# EAGLE design schemat (EAGLE 5.10)
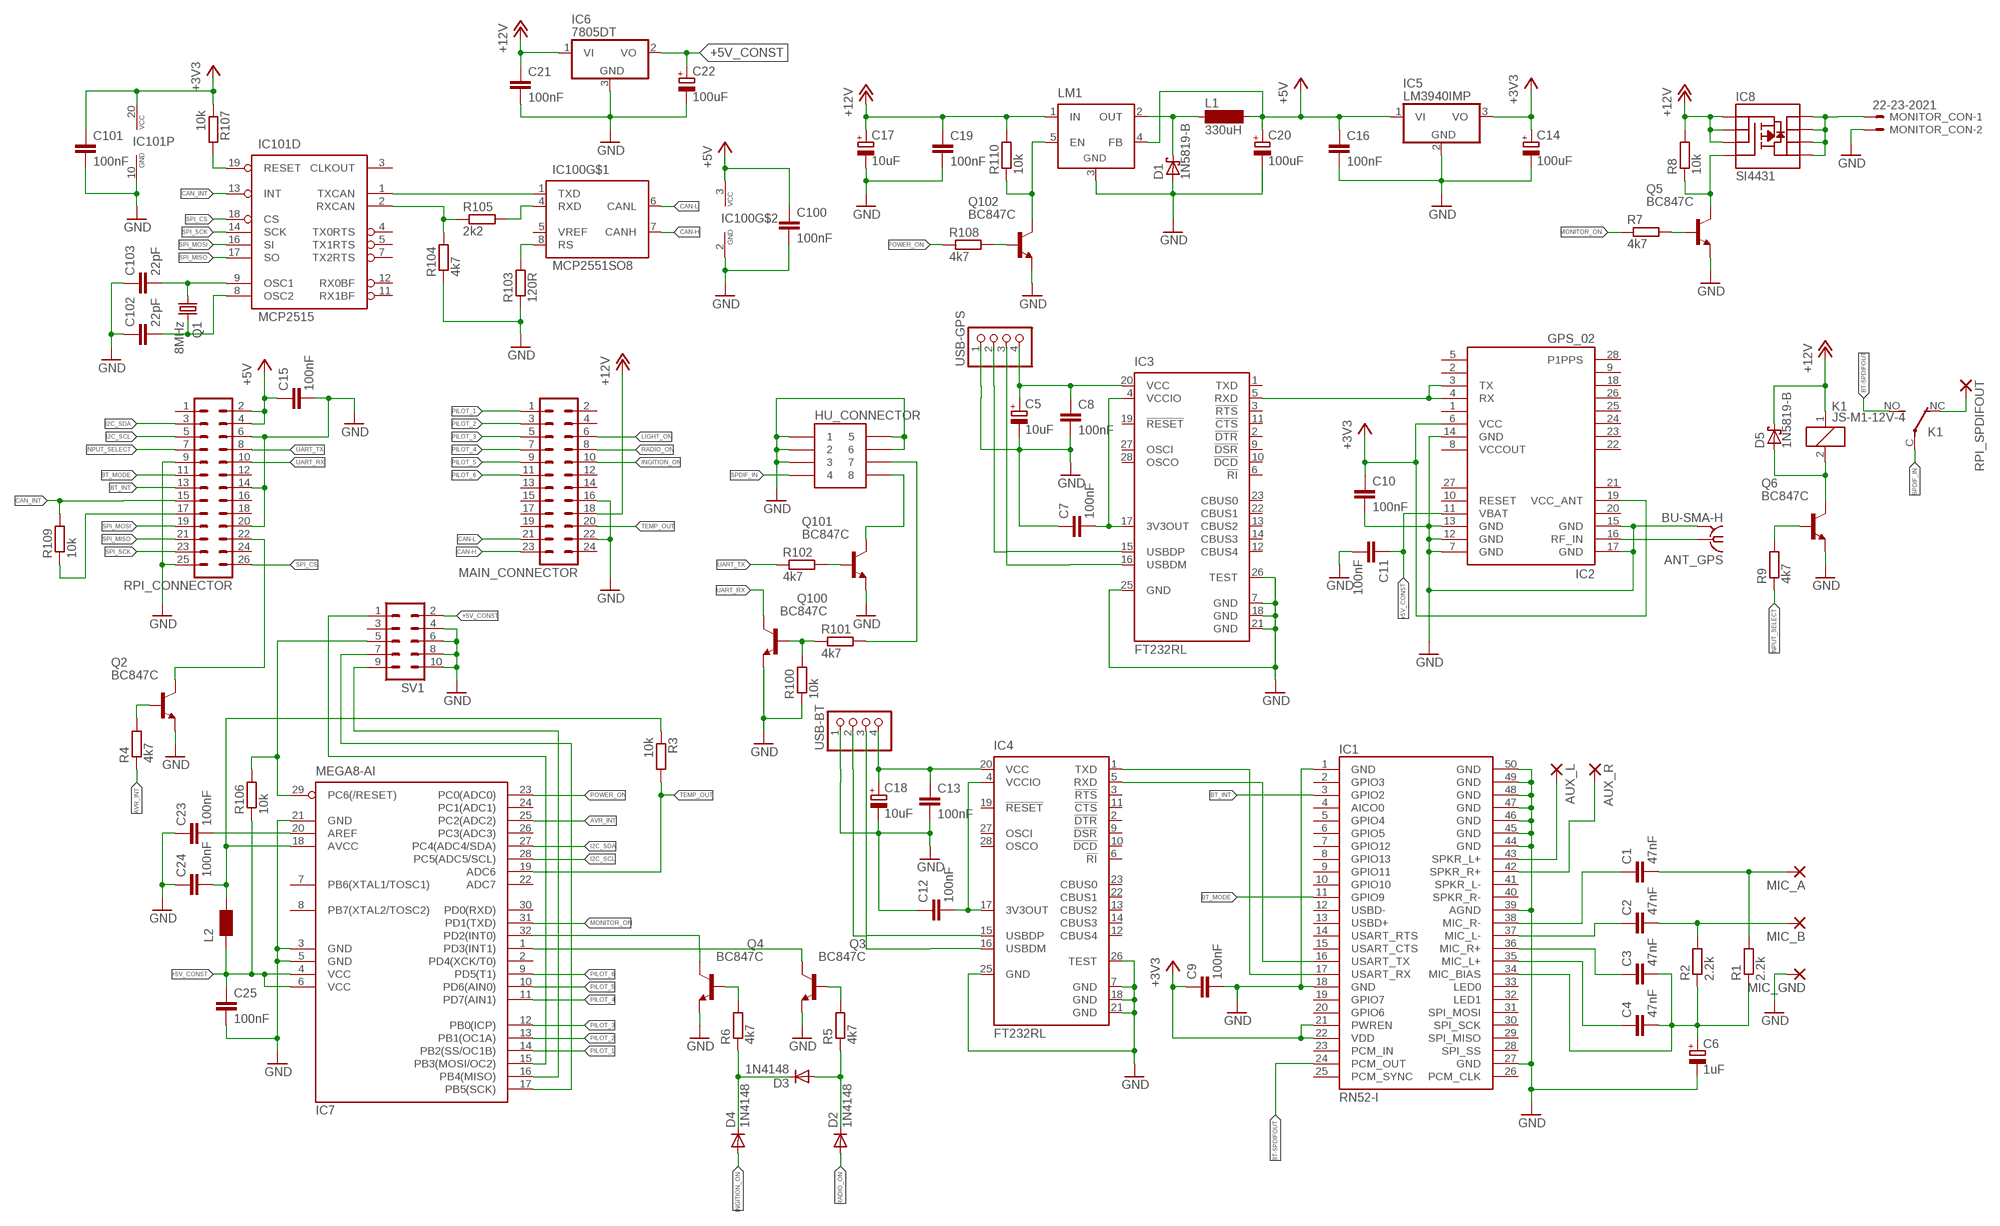
[diagram p0: schematic, sheet 1]

## Parts
ANT_GPS  BU-SMA-H  [BU-SMA-H]
AUX_L  1,6/0,8  [1,6/0,8]
AUX_R  1,6/0,8  [1,6/0,8]
C1  47nF  C-EUC0805  [C0805]
C2  47nF  C-EUC0805  [C0805]
C3  47nF  C-EUC0805  [C0805]
C4  47nF  C-EUC0805  [C0805]
C5  10uF  CPOL-EU153CLV-0605  [153CLV-0605]
C6  1uF  CPOL-EU153CLV-0605  [153CLV-0605]
C7  100nF  C-EUC0805  [C0805]
C8  100nF  C-EUC0805  [C0805]
C9  100nF  C-EUC0805  [C0805]
C10  100nF  C-EUC0805  [C0805]
C11  100nF  C-EUC0805  [C0805]
C12  100nF  C-EUC0805  [C0805]
C13  100nF  C-EUC0805  [C0805]
C14  100uF  CPOL-EU153CLV-0605  [153CLV-0605]
C15  100nF  C-EUC0805  [C0805]
C16  100nF  C-EUC0805  [C0805]
C17  10uF  CPOL-EU153CLV-0605  [153CLV-0605]
C18  10uF  CPOL-EU153CLV-0605  [153CLV-0605]
C19  100nF  C-EUC0805  [C0805]
C20  100uF  CPOL-EU153CLV-0605  [153CLV-0605]
C21  100nF  C-EUC0805  [C0805]
C22  100uF  CPOL-EU153CLV-0605  [153CLV-0605]
C23  100nF  C-EUC0805  [C0805]
C24  100nF  C-EUC0805  [C0805]
C25  100nF  C-EUC0805  [C0805]
C100  100nF  C-EUC0805  [C0805]
C101  100nF  C-EUC0805  [C0805]
C102  22pF  C-EUC0805  [C0805]
C103  22pF  C-EUC0805  [C0805]
D1  1N5819-B  [DO41-7.6]
D2  1N4148  1N4148DO35-7  [DO35-7]
D3  1N4148  1N4148DO35-7  [DO35-7]
D4  1N4148  1N4148DO35-7  [DO35-7]
D5  1N5819-B  [DO41-7.6]
HU_CONNECTOR  MRX56908CV  [MRX56908]
IC1  RN52-I  [RN-52]
IC2  GPS_02  [GPS_02]
IC3  FT232RL  [SSOP28]
IC4  FT232RL  [SSOP28]
IC5  LM3940IMP  [SOT223]
IC6  7805DT  [TO252]
IC7  MEGA8-AI  [TQFP32-08]
IC8  SI4431  MOSFET-PCHANNEL-SOIC8SOIC8  [SO08]
IC100  MCP2551SO8  [SO08]
IC101  MCP2515  MCP2515ST  [TSSOP20]
K1  JS-M1-12V-4  [JS-M]
L1  330uH  DLCSN136S  [DLCSN136S]
L2  WE-MK_0805  [0805]
LM1  LM2596TH  [TO220-52]
MAIN_CONNECTOR  MA12-2  [MA12-2]
MIC_A  3,81/1,4  [3,81/1,4]
MIC_B  3,81/1,4  [3,81/1,4]
MIC_GND  3,81/1,4  [3,81/1,4]
MONITOR_CON  22-23-2021  [22-23-2021]
Q1  8MHz  CRYSTALHC49S  [HC49/S]
Q2  BC847C  BC847C-NPN-SOT23-BEC  [SOT23-BEC]
Q3  BC847C  BC847C-NPN-SOT23-BEC  [SOT23-BEC]
Q4  BC847C  BC847C-NPN-SOT23-BEC  [SOT23-BEC]
Q5  BC847C  BC847C-NPN-SOT23-BEC  [SOT23-BEC]
Q6  BC847C  BC847C-NPN-SOT23-BEC  [SOT23-BEC]
Q100  BC847C  BC847C-NPN-SOT23-BEC  [SOT23-BEC]
Q101  BC847C  BC847C-NPN-SOT23-BEC  [SOT23-BEC]
Q102  BC847C  BC847C-NPN-SOT23-BEC  [SOT23-BEC]
R1  2.2k  R-EU_M0805  [M0805]
R2  2.2k  R-EU_M0805  [M0805]
R3  10k  R-EU_R0805  [R0805]
R4  4k7  R-EU_R0805  [R0805]
R5  4k7  R-EU_M0805  [M0805]
R6  4k7  R-EU_M0805  [M0805]
R7  4k7  R-EU_M0805  [M0805]
R8  10k  R-EU_M0805  [M0805]
R9  4k7  R-EU_M0805  [M0805]
R100  10k  R-EU_M0805  [M0805]
R101  4k7  R-EU_M0805  [M0805]
R102  4k7  R-EU_M0805  [M0805]
R103  120R  R-EU_R0805  [R0805]
R104  4k7  R-EU_R0805  [R0805]
R105  2k2  R-EU_R0805  [R0805]
R106  10k  R-EU_R0805  [R0805]
R107  10k  R-EU_R0805  [R0805]
R108  4k7  R-EU_M0805  [M0805]
R109  10k  R-EU_R0805  [R0805]
R110  10k  R-EU_M0805  [M0805]
RPI_CONNECTOR  MA13-2  [MA13-2]
RPI_SPDIFOUT  3,17/1,1  [3,17/1,1]
SV1  ML10  [ML10]
USB-BT  PINHD-1X4  [1X04]
USB-GPS  PINHD-1X4  [1X04]

## Nets
+3V3 [zasilanie]: C9.1 C10.1 C14.+ C101.1 IC1.21(PWREN) IC1.22(VDD) IC2.6(VCC) IC2.19(VCC_ANT) IC5.3(VO) IC101.20(P:VCC) R107.1
+5V [zasilanie]: C15.1 C16.1 C20.+ C100.1 IC5.1(VI) IC100.3(VCC) L1.P$2 LM1.4(FB) RPI_CONNECTOR.2 RPI_CONNECTOR.4
+5V_CONST [zasilanie]: C11.1 C22.+ C25.1 IC2.11(VBAT) IC6.2(VO) IC7.4(VCC) IC7.6(VCC) L2.1 R106.1 SV1.2
+12V: C17.+ C19.1 C21.1 D5.C IC6.1(VI) IC8.1(S) IC8.2(S) IC8.3(S) K1.1 LM1.1(IN) MAIN_CONNECTOR.18 R8.2 R110.2
AVCC: C24.2 IC7.18(AVCC) L2.2 R3.1
AVR_INT: IC7.25(PC2(ADC2)) R4.1
BT-SPDIFOUT: IC1.24(PCM_OUT) K1.NO(2:S)
BT_INT: IC1.3(GPIO2) RPI_CONNECTOR.13
BT_MODE: IC1.11(GPIO9) RPI_CONNECTOR.11
CAN-H: IC100.7(CANH) MAIN_CONNECTOR.23
CAN-L: IC100.6(CANL) MAIN_CONNECTOR.21
CAN_INT: IC101.13(D:INT) R109.2 RPI_CONNECTOR.15
GND: ANT_GPS.2(GND) C5.- C6.- C7.1 C8.2 C9.2 C10.2 C11.2 C12.1 C13.2 C14.- C15.2 C16.2 C17.- C18.- C19.2 C20.- C21.2 C22.- C23.1 C24.1 C25.2 C100.2 C101.2 C102.1 C103.1 D1.A HU_CONNECTOR.P1 HU_CONNECTOR.P2 HU_CONNECTOR.P3 HU_CONNECTOR.P5 HU_CONNECTOR.P6 IC1.1(GND) IC1.18(GND) IC1.27(GND) IC1.39(AGND) IC1.44(GND) IC1.45(GND) IC1.46(GND) IC1.47(GND) IC1.48(GND) IC1.49(GND) IC1.50(GND) IC2.7(GND) IC2.12(GND) IC2.13(GND) IC2.14(GND) IC2.15(GND) IC2.17(GND) IC3.7(GND) IC3.18(GND) IC3.21(GND) IC3.25(GND) IC3.26(TEST) IC4.7(GND) IC4.18(GND) IC4.21(GND) IC4.25(GND) IC4.26(TEST) IC5.2(GND) IC6.3(GND) IC7.3(GND) IC7.5(GND) IC7.21(GND) IC100.2(GND) IC101.10(P:GND) LM1.3(GND) MAIN_CONNECTOR.16 MAIN_CONNECTOR.22 MIC_GND.1(P) MONITOR_CON.2 Q2.E Q3.E Q4.E Q5.E Q6.E Q100.E Q101.E Q102.E R100.1 R103.1 R104.1 RPI_CONNECTOR.6 RPI_CONNECTOR.9 RPI_CONNECTOR.14 RPI_CONNECTOR.20 RPI_CONNECTOR.25 SV1.4 SV1.6 SV1.8 SV1.10 USB-BT.1 USB-GPS.1
I2C_SCL: IC7.28(PC5(ADC5/SCL)) RPI_CONNECTOR.5
I2C_SDA: IC7.27(PC4(ADC4/SDA)) RPI_CONNECTOR.3
INGITION_ON: D4.A MAIN_CONNECTOR.10
INPUT_SELECT: R9.1 RPI_CONNECTOR.7
LIGHT_ON: MAIN_CONNECTOR.6
MIC_A: C1.2 MIC_A.1(P) R1.2
MIC_B: C2.2 MIC_B.1(P) R2.2
MONITOR_ON: IC7.31(PD1(TXD)) R7.1
N$1: IC100.8(RS) R103.2
N$2: IC100.1(TXD) IC101.1(D:TXCAN)
N$3: IC100.4(RXD) R105.2
N$4: C103.2 IC101.9(D:OSC1) Q1.1
N$5: IC101.19(D:RESET) R107.2
N$6: IC101.2(D:RXCAN) R104.2 R105.1
N$7: C102.2 IC101.8(D:OSC2) Q1.2
N$8: C1.1 IC1.38(MIC_R-)
N$9: IC7.17(PB5(SCK)) SV1.7
N$10: C23.2 IC7.20(AREF)
N$11: IC7.29(PC6(/RESET)) R106.2 SV1.5
N$12: IC7.16(PB4(MISO)) SV1.9
N$13: IC7.15(PB3(MOSI/OC2)) SV1.1
N$14: R109.1 RPI_CONNECTOR.17
N$15: C13.1 C18.+ IC4.20(VCC) USB-BT.4
N$16: IC1.16(USART_TX) IC4.5(RXD)
N$17: IC4.16(USBDM) USB-BT.3
N$18: IC4.15(USBDP) USB-BT.2
N$19: IC1.17(USART_RX) IC4.1(TXD)
N$20 [zasilanie]: C7.2 IC3.4(VCCIO) IC3.17(3V3OUT)
N$21: IC8.5(D) IC8.6(D) IC8.7(D) IC8.8(D) MONITOR_CON.1
N$22 [zasilanie]: C12.2 IC4.4(VCCIO) IC4.17(3V3OUT)
N$23: Q101.B R102.2
N$24: Q102.B R108.2
N$25: LM1.5(EN) Q102.C R110.1
N$26: IC7.1(PD3(INT1)) Q3.C
N$27: Q4.B R6.2
N$28: IC7.32(PD2(INT0)) Q4.C
N$29: Q3.B R5.2
N$30: D3.C D4.C R6.1
N$31: D2.C D3.A R5.1
N$32: HU_CONNECTOR.P7 R101.2
N$33: Q100.B R100.2 R101.1
N$34: HU_CONNECTOR.P8 Q101.C
N$35: Q2.C RPI_CONNECTOR.22
N$36: Q2.B R4.2
N$37: D5.A K1.2 Q6.C
N$38: AUX_L.1(P) IC1.43(SPKR_L+)
N$39: AUX_R.1(P) IC1.42(SPKR_R+)
N$40: Q6.B R9.2
N$41: D1.C L1.P$1 LM1.2(OUT)
N$43: C2.1 IC1.37(MIC_L-)
N$45: K1.NC(2:O) RPI_SPDIFOUT.1(P)
N$48: C4.1 IC1.35(MIC_L+)
N$49: C3.2 C4.2 C6.+ IC1.34(MIC_BIAS) R1.1 R2.1
N$50: C3.1 IC1.36(MIC_R+)
N$53: Q5.B R7.2
N$56: ANT_GPS.1 IC2.16(RF_IN)
N$62: IC2.3(TX) IC2.4(RX) IC3.5(RXD)
N$67: IC8.4(G) Q5.C R8.1
N$68: C5.+ C8.1 IC3.20(VCC) USB-GPS.4
N$70: IC3.16(USBDM) USB-GPS.3
N$71: IC3.15(USBDP) USB-GPS.2
PILOT_1: IC7.14(PB2(SS/OC1B)) MAIN_CONNECTOR.1
PILOT_2: IC7.13(PB1(OC1A)) MAIN_CONNECTOR.3
PILOT_3: IC7.12(PB0(ICP)) MAIN_CONNECTOR.5
PILOT_4: IC7.11(PD7(AIN1)) MAIN_CONNECTOR.7
PILOT_5: IC7.10(PD6(AIN0)) MAIN_CONNECTOR.9
PILOT_6: IC7.9(PD5(T1)) MAIN_CONNECTOR.11
POWER_ON: IC7.23(PC0(ADC0)) R108.1
RADIO_ON: D2.A MAIN_CONNECTOR.8
SPDIF_IN: HU_CONNECTOR.P4 K1.C(2:P)
SPI_CS: IC101.18(D:CS) RPI_CONNECTOR.26
SPI_MISO: IC101.17(D:SO) RPI_CONNECTOR.21
SPI_MOSI: IC101.16(D:SI) RPI_CONNECTOR.19
SPI_SCK: IC101.14(D:SCK) RPI_CONNECTOR.23
TEMP_OUT: IC7.19(ADC6) MAIN_CONNECTOR.20 R3.2
UART_RX: Q100.C RPI_CONNECTOR.10
UART_TX: R102.1 RPI_CONNECTOR.8
Unconnected: IC1.2(GPIO3) IC1.4(AICO0) IC1.5(GPIO4) IC1.6(GPIO5) IC1.7(GPIO12) IC1.8(GPIO13) IC1.9(GPIO11) IC1.10(GPIO10) IC1.12(USBD-) IC1.13(USBD+) IC1.14(USART_RTS) IC1.15(USART_CTS) IC1.19(GPIO7) IC1.20(GPIO6) IC1.23(PCM_IN) IC1.25(PCM_SYNC) IC1.26(PCM_CLK) IC1.28(SPI_SS) IC1.29(SPI_MISO) IC1.30(SPI_SCK) IC1.31(SPI_MOSI) IC1.32(LED1) IC1.33(LED0) IC1.40(SPKR_R-) IC1.41(SPKR_L-) IC2.1(NC) IC2.2(NC) IC2.5(NC) IC2.9(NC) IC2.10(RESET) IC2.18(NC) IC2.20(NC) IC2.21(NC) IC2.22(NC) IC2.23(NC) IC2.24(NC) IC2.25(NC) IC2.26(NC) IC2.27(NC) IC2.28(P1PPS) IC3.1(TXD) IC3.2(!DTR) IC3.3(!RTS) IC3.6(!RI) IC3.9(!DSR) IC3.10(!DCD) IC3.11(!CTS) IC3.12(CBUS4) IC3.13(CBUS2) IC3.14(CBUS3) IC3.19(!RESET) IC3.22(CBUS1) IC3.23(CBUS0) IC3.27(OSCI) IC3.28(OSCO) IC4.2(!DTR) IC4.3(!RTS) IC4.6(!RI) IC4.9(!DSR) IC4.10(!DCD) IC4.11(!CTS) IC4.12(CBUS4) IC4.13(CBUS2) IC4.14(CBUS3) IC4.19(!RESET) IC4.22(CBUS1) IC4.23(CBUS0) IC4.27(OSCI) IC4.28(OSCO) IC7.2(PD4(XCK/T0)) IC7.7(PB6(XTAL1/TOSC1)) IC7.8(PB7(XTAL2/TOSC2)) IC7.22(ADC7) IC7.24(PC1(ADC1)) IC7.26(PC3(ADC3)) IC7.30(PD0(RXD)) IC100.5(VREF) IC101.3(D:CLKOUT) IC101.4(D:TX0RTS) IC101.5(D:TX1RTS) IC101.7(D:TX2RTS) IC101.11(D:RX1BF) IC101.12(D:RX0BF) MAIN_CONNECTOR.2 MAIN_CONNECTOR.4 MAIN_CONNECTOR.12 MAIN_CONNECTOR.13 MAIN_CONNECTOR.14 MAIN_CONNECTOR.15 MAIN_CONNECTOR.17 MAIN_CONNECTOR.19 MAIN_CONNECTOR.24 RPI_CONNECTOR.1 RPI_CONNECTOR.12 RPI_CONNECTOR.16 RPI_CONNECTOR.18 RPI_CONNECTOR.24 SV1.3

## Power pins joined to a net without a drawn wire
GND: ANT_GPS.3(GND) ANT_GPS.4(GND) ANT_GPS.5(GND)
VCCOUT: IC2.8(VCCOUT)

## Library data of the parts
ANT_GPS = con-coax:BU-SMA-H: FEMALE SMA CONNECTOR Radiall
AUX_L AUX_R = wirepad:1,6/0,8: THROUGH-HOLE PAD
C1-C4 C7-C9 C12 C13 C15 C19 C21 C23-C25 C100-C103 = rcl:C-EU: CAPACITOR, European symbol
C5 C6 C18 = rcl:CPOL-EU: POLARIZED CAPACITOR, European symbol
C10 C11 C16 = resistor:C-EU: CAPACITOR, European symbol
C14 C17 C20 C22 = resistor:CPOL-EU: POLARIZED CAPACITOR, European symbol
D1 D5 = diode:1N581*: 1.0A SCHOTTKY BARRIER RECTIFIER Source: http://www.diodes.com/datasheets/ds23001.pdf
D2-D4 = diode:1N4148: DIODE high speed (Philips)
HU_CONNECTOR = moja:MRX56908CV
IC1 = moja:RN52-I
IC2 = moja:GPS_02
IC3 IC4 = ftdichip:FT232R: Source: http://www.ftdichip.com/Documents/DataSheets/DS_FT232R_v104.pdf
IC5 = moja:LM3940IMP
IC6 = linear:78*: Positive VOLTAGE REGULATOR Source: http://cache.national.com/ds/LM/LM78L05.pdf http://www.fairchildsemi.com/ds/LM/LM7805.pdf
IC7 = atmel:MEGA8: MICROCONTROLLER 8 Kbytes FLASH, 1 kbytes SRAM, 512 bytes EEPROM, USART, 6-channel 10 bit ADC, 2-channel 8 bit ADC Pin compatible with Atmega48, ATMega88, ATMega168 Source: avr.lbr
IC8 = SparkFun:MOSFET-PCHANNEL-SOIC8
IC100 = can:MCP2551: CAN Tranceiver Microchip
IC101 = can:MCP2515: MC2515 Stand-Alone CAN Controller With SPI Interface, Microchip
K1 = relay:JS-M1*: Automotive Ultra-Miniature Power Relay NAiS Source: http://www.mew-europe.com/.. en_ds_61211_0000.pdf
L1 = moja:DLCSN136S
L2 = wuerth-elektronik:WE-MK: SMD Multilayer Ceramic Inductors WE-MK - Windings printed on ceramic substrate - Extremely high SRF > 15 GHz - Inductance is stable over temperature -- High frequency circuits -- Bluetooth -- Wireless LAN -- Filter circuits
LM1 = linear:LM2596T: STEP-DOWN VOLTAGE REGULATOR
MAIN_CONNECTOR = con-lstb:MA12-2: PIN HEADER
MIC_A MIC_B MIC_GND = wirepad:3,81/1,4: THROUGH-HOLE PAD
MONITOR_CON = con-molex:22-23-2021: .100" (2.54mm) Center Header - 2 Pin
Q1 = crystal:CRYSTAL: CRYSTAL
Q2-Q6 Q100-Q102 = transistor:*-NPN-: NPN Transistror BF959 corrected 2008.03.06
R1 R2 R5-R9 R100-R102 R108 R110 = rcl:R-EU_: RESISTOR, European symbol
R3 R4 R103-R107 R109 = resistor:R-EU_: RESISTOR, European symbol
RPI_CONNECTOR = con-lstb:MA13-2: PIN HEADER
RPI_SPDIFOUT = wirepad:3,17/1,1: THROUGH-HOLE PAD
SV1 = con-harting-ml:ML10: HARTING
USB-BT USB-GPS = pinhead:PINHD-1X4: PIN HEADER

## Net classes
1 zasilanie: clearance 1.5 mm

## Board
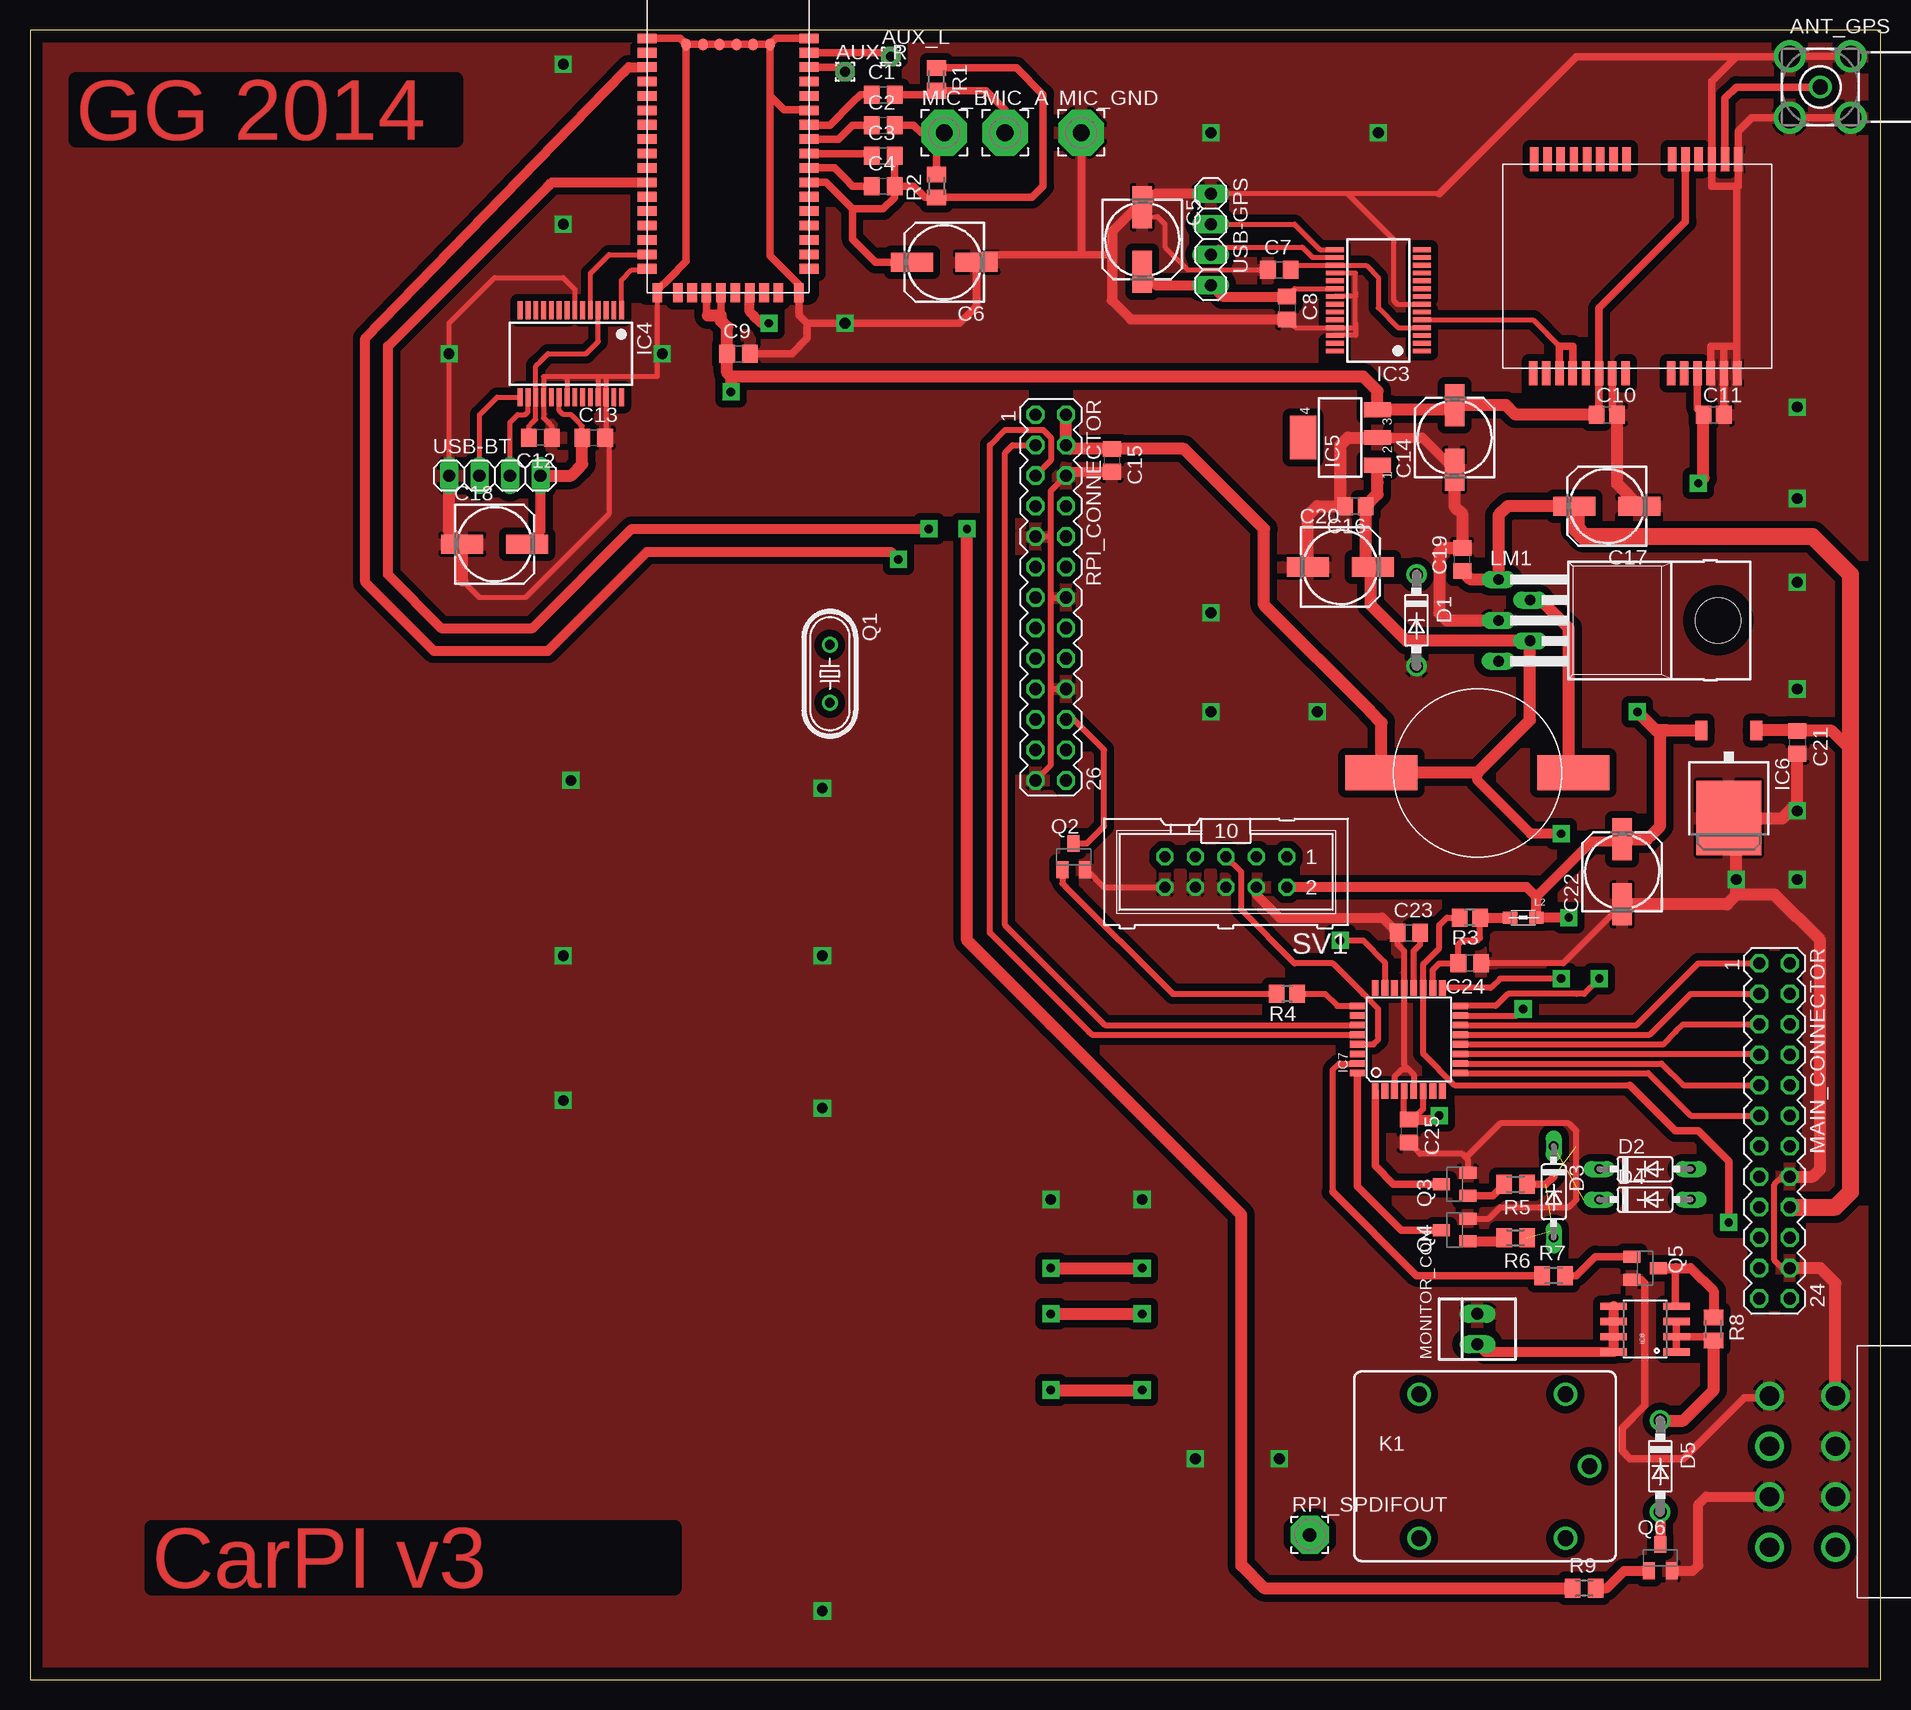
[diagram p1: board, top side]
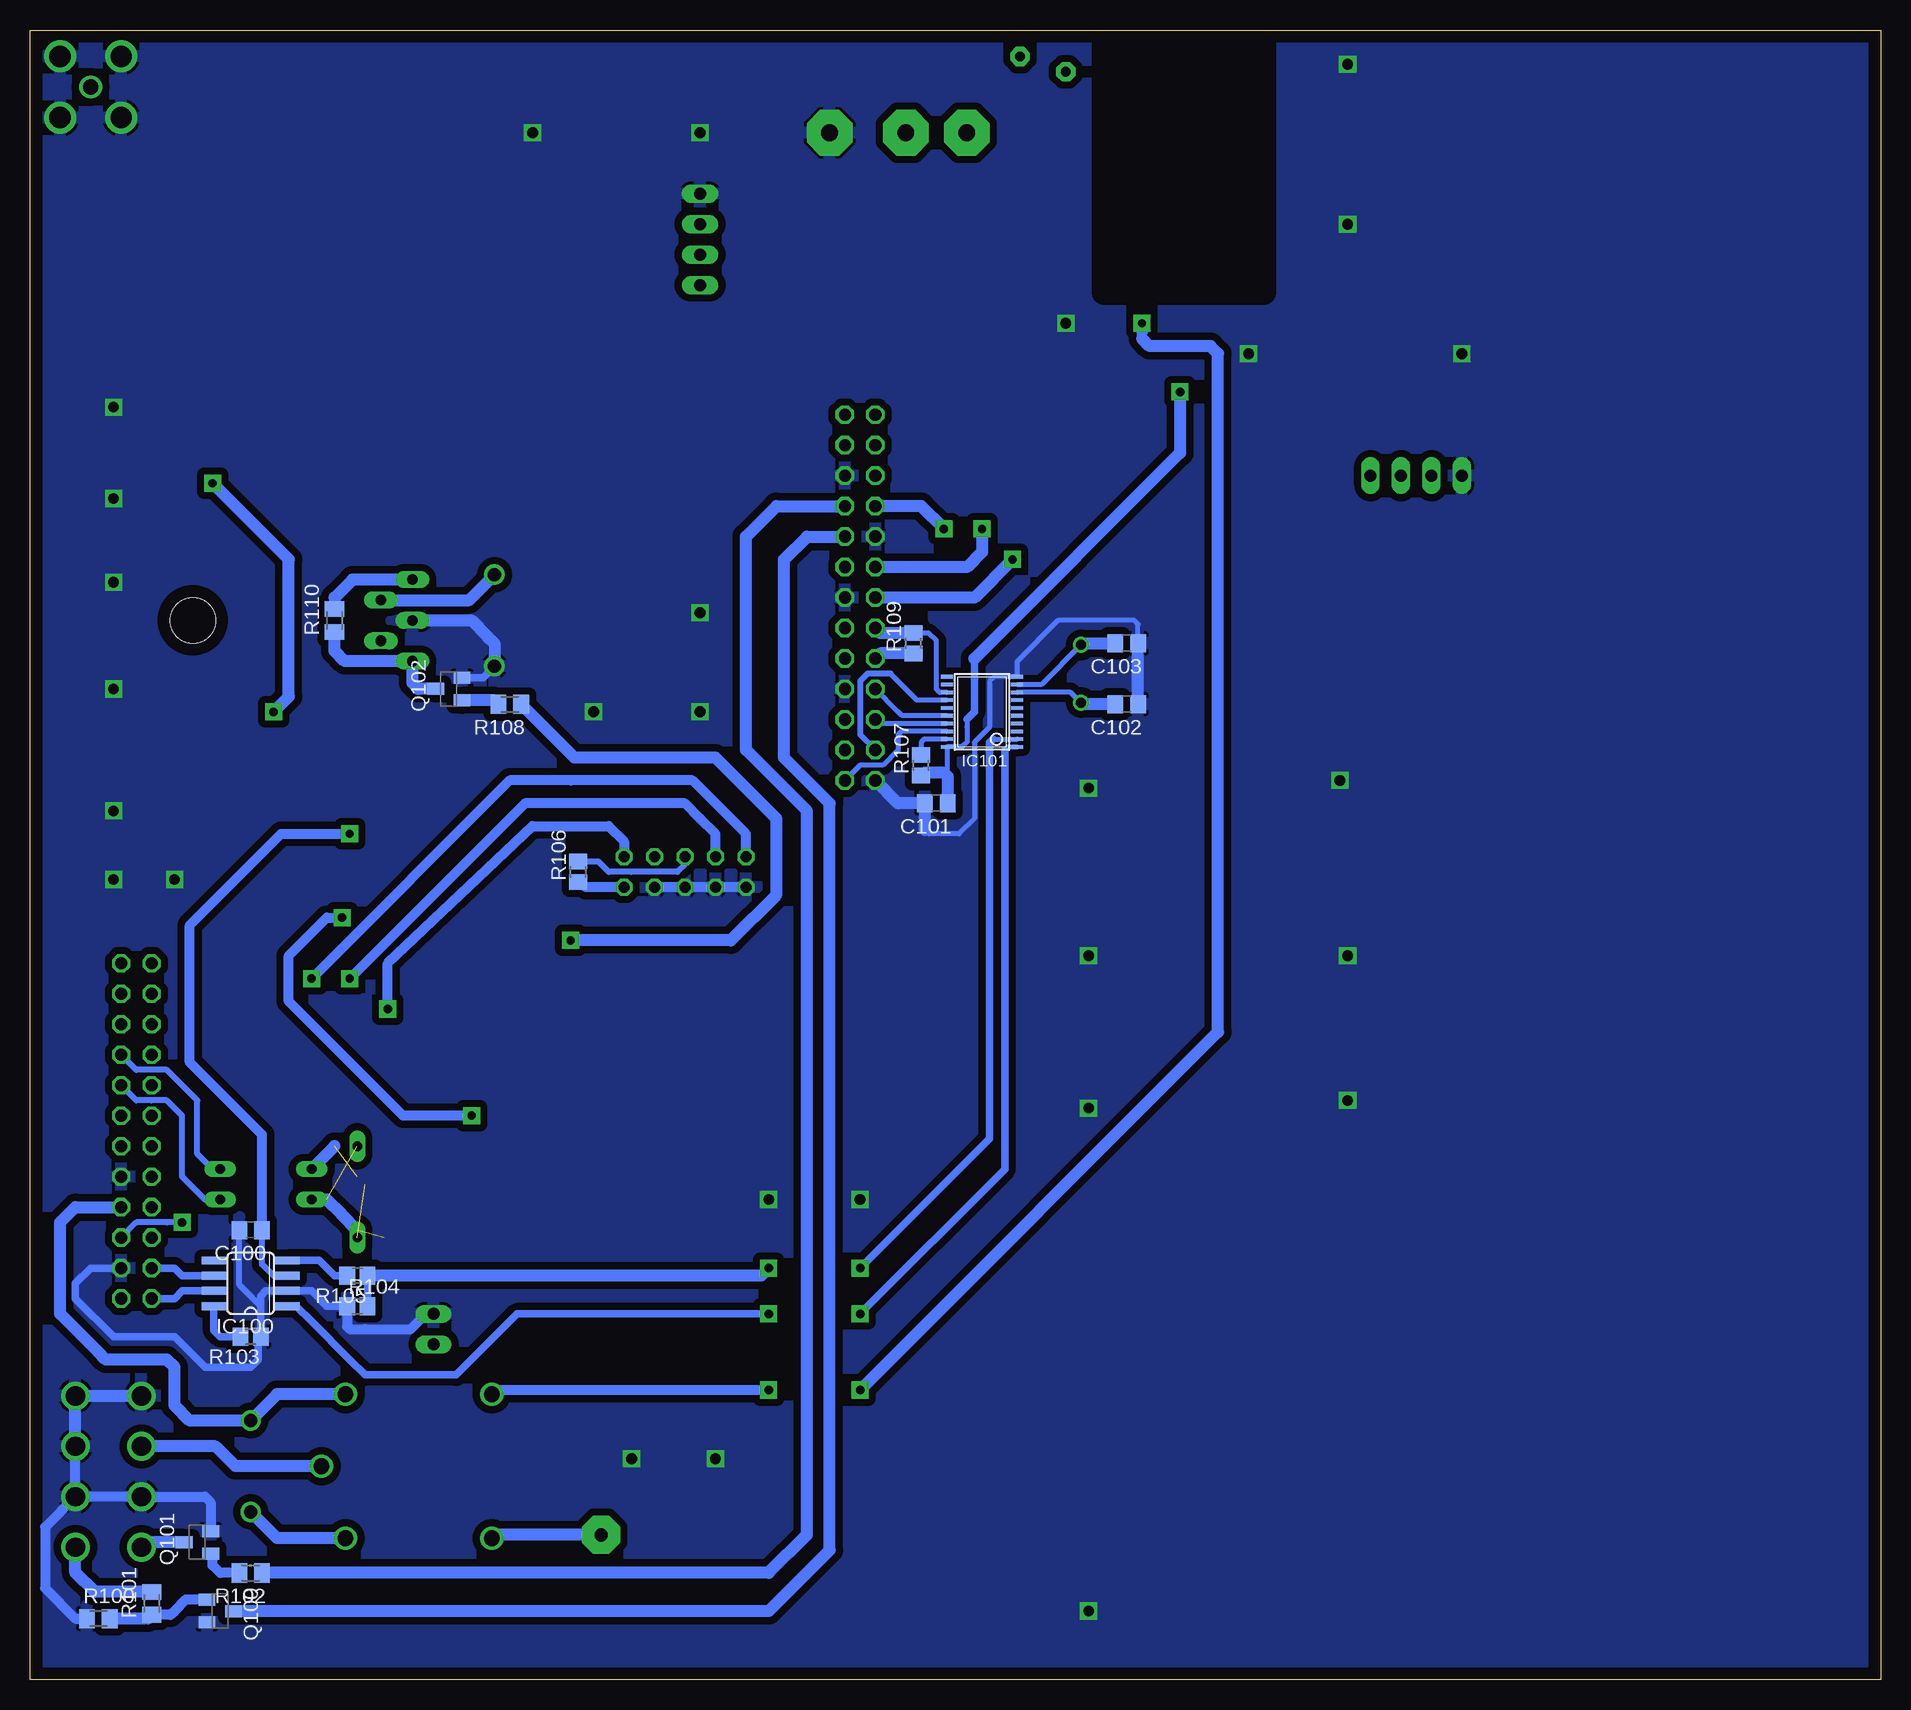
[diagram p2: board, bottom side, seen from below]

Size 154.28 x 137.47 mm. Coordinates in mm from the lower left corner, seen from the top.
Outline: 0,0 154.28,0 154.28,137.47 0,137.47 0,0
Copper layers (1*16): Top 0.035mm / dielectric 1.5mm / Bottom 0.035mm
Design rules "default": minimum track width 10mil, minimum drill 24mil, track to track 8mil, track to pad 8mil, pad to pad 8mil, via to via 8mil, smd to smd 8mil, copper to edge 40mil, drill to drill 8mil, minimum pad ring 10mil, minimum via ring 8mil, stop-mask expansion 4mil, vias tented up to drill 0mil, thermal gap 10mil
tRestrict: area 51.4,115.6 to 64.8,137.8
bRestrict: area 51.4,115.6 to 64.8,137.8

### Footprints (pad centres in the part's own frame; a part is rotated, then mirrored left to right if it is on the bottom)
BU-SMA-H = drill 1.27 round: 1 0,0 | drill 1.778 round: 2 -2.55,2.55; 3 2.55,2.55; 4 2.55,-2.55; 5 -2.55,-2.55
1,6/0,8 = drill 0.813 pad 1.6 octagon: 1 0,0
C0805 = smd 1.3 x 1.5: 1 -0.95,0; 2 0.95,0
153CLV-0605 = smd 3.5 x 1.6: + 2.7,0; - -2.7,0
C0805' = smd 1.3 x 1.5: 1 -0.85,0; 2 0.85,0
DO41-7.6 = drill 1.1 pad 1.7 round: A 3.81,0; C -3.81,0
DO35-7 = drill 0.813 long: A 3.81,0; C -3.81,0
MRX56908 = drill 1.6 round: P1 8.4,0; P2 8.4,5.5; P3 4.2,0; P4 4.2,5.5; P5 0,0; P6 0,5.5; P7 -4.2,0; P8 -4.2,5.5
RN-52 = smd 1.6 x 0.8: 1 -7.62,9.77; 2 -7.62,8.57; 3 -7.62,7.37; 4 -7.62,6.17; 5 -7.62,4.97; 6 -7.62,3.77; 7 -7.62,2.57; 8 -7.62,1.37; 9 -7.62,0.17; 10 -7.62,-1.03; 11 -7.62,-2.23; 12 -7.62,-3.43; 13 -7.62,-4.63; 14 -7.62,-5.83; 15 -7.62,-7.03; 16 -7.62,-8.23; 17 -7.62,-9.43; 28 5.88,-9.43; 29 5.88,-8.23; 30 5.88,-7.03; 31 5.88,-5.83; 32 5.88,-4.63; 33 5.88,-3.43; 34 5.88,-2.23; 35 5.88,-1.03; 36 5.88,0.17; 37 5.88,1.37; 38 5.88,2.57; 39 5.88,3.77; 40 5.88,4.97; 41 5.88,6.17; 42 5.88,7.37; 43 5.88,8.57; 44 5.88,9.77 | smd 0.8 x 1.6: 18 -6.77,-11.43; 19 -5.07,-11.43; 20 -3.87,-11.43; 21 -2.67,-11.43; 22 -1.47,-11.43; 23 -0.27,-11.43; 24 0.93,-11.43; 25 2.13,-11.43; 26 3.33,-11.43; 27 5.03,-11.43 | smd 0.8 x 1: 45 2.63,9.27; 46 1.23,9.27; 47 -0.17,9.27; 48 -1.57,9.27; 49 -2.97,9.27; 50 -4.37,9.27
GPS_02 = smd 2 x 0.7: 1 8.6,-8.7; 2 8.6,-7.6; 3 8.6,-6.5; 4 8.6,-5.4; 5 8.6,-4.3; 6 8.6,-3.2; 7 8.6,-2.1; 8 8.6,-1; 9 8.6,2.8; 10 8.6,3.9; 11 8.6,5; 12 8.6,6.1; 13 8.6,7.2; 14 8.6,8.3; 15 -9.2,8.4; 16 -9.2,7.3; 17 -9.2,6.2; 18 -9.2,5.1; 19 -9.2,4; 20 -9.2,2.9; 21 -9.2,-0.9; 22 -9.2,-2; 23 -9.2,-3.1; 24 -9.2,-4.2; 25 -9.2,-5.3; 26 -9.2,-6.4; 27 -9.2,-7.5; 28 -9.2,-8.6
SSOP28 = smd 0.4 x 1.5: 1 -4.225,-3.625; 2 -3.575,-3.625; 3 -2.925,-3.625; 4 -2.275,-3.625; 5 -1.625,-3.625; 6 -0.975,-3.625; 7 -0.325,-3.625; 8 0.325,-3.625; 9 0.975,-3.625; 10 1.625,-3.625; 11 2.275,-3.625; 12 2.925,-3.625; 13 3.575,-3.625; 14 4.225,-3.625; 15 4.225,3.625; 16 3.575,3.625; 17 2.925,3.625; 18 2.275,3.625; 19 1.625,3.625; 20 0.975,3.625; 21 0.325,3.625; 22 -0.325,3.625; 23 -0.975,3.625; 24 -1.625,3.625; 25 -2.275,3.625; 26 -2.925,3.625; 27 -3.575,3.625; 28 -4.225,3.625
SOT223 = smd 1.219 x 2.235: 1 -2.311,-3.099; 2 0,-3.099; 3 2.311,-3.099 | smd 3.6 x 2.2: 4 0,3.099
TO252 = smd 1 x 1.6: 1 -2.28,-4.8; 2 2.28,-4.8 | smd 5.4 x 6.2: 3 0,2.5
TQFP32-08 = smd 1.27 x 0.559: 1 -4.293,2.8; 2 -4.293,2; 3 -4.293,1.2; 4 -4.293,0.4; 5 -4.293,-0.4; 6 -4.293,-1.2; 7 -4.293,-2; 8 -4.293,-2.8; 17 4.293,-2.8; 18 4.293,-2; 19 4.293,-1.2; 20 4.293,-0.4; 21 4.293,0.4; 22 4.293,1.2; 23 4.293,2; 24 4.293,2.8 | smd 0.559 x 1.27: 9 -2.8,-4.293; 10 -2,-4.293; 11 -1.2,-4.293; 12 -0.4,-4.293; 13 0.4,-4.293; 14 1.2,-4.293; 15 2,-4.293; 16 2.8,-4.293; 25 2.8,4.293; 26 2,4.293; 27 1.2,4.293; 28 0.4,4.293; 29 -0.4,4.293; 30 -1.2,4.293; 31 -2,4.293; 32 -2.8,4.293
SO08 = smd 0.61 x 2.21: 1 -1.905,-2.616; 2 -0.635,-2.616; 3 0.635,-2.616; 4 1.905,-2.616; 5 1.905,2.616; 6 0.635,2.616; 7 -0.635,2.616; 8 -1.905,2.616
SO08' = smd 0.66 x 2.032: 1 -1.905,-3.073; 2 -0.635,-3.073; 3 0.635,-3.073; 4 1.905,-3.073; 5 1.905,3.073; 6 0.635,3.073; 7 -0.635,3.073; 8 -1.905,3.073
TSSOP20 = smd 0.305 x 0.991: 1 -2.925,-2.918; 2 -2.275,-2.918; 3 -1.625,-2.918; 4 -0.975,-2.918; 5 -0.325,-2.918; 6 0.325,-2.918; 7 0.975,-2.918; 8 1.625,-2.918; 9 2.275,-2.918; 10 2.925,-2.918; 11 2.925,2.918; 12 2.275,2.918; 13 1.625,2.918; 14 0.975,2.918; 15 0.325,2.918; 16 -0.325,2.918; 17 -0.975,2.918; 18 -1.625,2.918; 19 -2.275,2.918; 20 -2.925,2.918
JS-M = drill 1.3 round: 1 6.7,6; 2 6.7,-6; C 8.7,0; NC -5.5,-6; NO -5.5,6
DLCSN136S = smd 6 x 2.9: P$1 -8,0; P$2 8,0
0805 = smd 1.2 x 1: 1 -1.1,0; 2 1.1,0
TO220-52 = drill 0.9 long: 1 -3.4,-21.1; 2 -1.7,-18.47; 3 0,-21.1; 4 1.7,-18.47; 5 3.4,-21.1 | hole 3.8: 0,-2.8
MA12-2 = drill 1.016 octagon: 1 -13.97,-1.27; 2 -13.97,1.27; 3 -11.43,-1.27; 4 -11.43,1.27; 5 -8.89,-1.27; 6 -8.89,1.27; 7 -6.35,-1.27; 8 -6.35,1.27; 9 -3.81,-1.27; 10 -3.81,1.27; 11 -1.27,-1.27; 12 -1.27,1.27; 13 1.27,-1.27; 14 1.27,1.27; 15 3.81,-1.27; 16 3.81,1.27; 17 6.35,-1.27; 18 6.35,1.27; 19 8.89,-1.27; 20 8.89,1.27; 21 11.43,-1.27; 22 11.43,1.27; 23 13.97,-1.27; 24 13.97,1.27
3,81/1,4 = drill 1.397 pad 3.81 octagon: 1 0,0
22-23-2021 = drill 1 long: 1 -1.27,0; 2 1.27,0
HC49/S = drill 0.813 round: 1 -2.413,0; 2 2.413,0
SOT23-BEC = smd 1 x 1.4: B -0.95,-1.1; C 0,1.1; E 0.95,-1.1
M0805 = smd 1.3 x 1.6: 1 -0.95,0; 2 0.95,0
R0805 = smd 1.3 x 1.5: 1 -0.85,0; 2 0.85,0
MA13-2 = drill 1.016 octagon: 1 -15.24,-1.27; 2 -15.24,1.27; 3 -12.7,-1.27; 4 -12.7,1.27; 5 -10.16,-1.27; 6 -10.16,1.27; 7 -7.62,-1.27; 8 -7.62,1.27; 9 -5.08,-1.27; 10 -5.08,1.27; 11 -2.54,-1.27; 12 -2.54,1.27; 13 0,-1.27; 14 0,1.27; 15 2.54,-1.27; 16 2.54,1.27; 17 5.08,-1.27; 18 5.08,1.27; 19 7.62,-1.27; 20 7.62,1.27; 21 10.16,-1.27; 22 10.16,1.27; 23 12.7,-1.27; 24 12.7,1.27; 25 15.24,-1.27; 26 15.24,1.27
3,17/1,1 = drill 1.118 pad 3.175 octagon: 1 0,0
ML10 = drill 0.914 octagon: 1 -5.08,-1.27; 2 -5.08,1.27; 3 -2.54,-1.27; 4 -2.54,1.27; 5 0,-1.27; 6 0,1.27; 7 2.54,-1.27; 8 2.54,1.27; 9 5.08,-1.27; 10 5.08,1.27
1X04 = drill 1.016 long: 1 -3.81,0; 2 -1.27,0; 3 1.27,0; 4 3.81,0

### Placement (x,y rotation side)
ANT_GPS  149.22,132.72 0 top
AUX_L  71.75,135.25 0 top
AUX_R  67.94,133.99 0 top
C1  71.12,132.08 0 top
C2  71.12,129.54 0 top
C3  71.12,127 0 top
C4  71.12,124.46 0 top
C5  92.71,120.02 270 top
C6  76.2,118.11 180 top
C7  104.14,117.47 0 top
C8  104.78,114.3 270 top
C9  59.05,110.49 0 top
C10  100nF  [C0805']  131.44,105.41 0 top
C11  100nF  [C0805']  140.34,105.41 0 top
C12  42.55,103.5 180 top
C13  46.99,103.5 0 top
C14  118.75,103.5 90 top
C15  90.17,101.6 270 top
C16  100nF  [C0805']  110.49,97.79 180 top
C17  131.44,97.79 180 top
C18  38.73,94.61 0 top
C19  119.38,93.34 90 top
C20  109.22,92.71 0 top
C21  147.32,78.11 270 top
C22  132.72,67.31 90 top
C23  114.94,62.23 0 top
C24  120.02,59.69 180 top
C25  114.94,45.72 270 top
C100  135.89,37.47 180 bottom
C101  78.74,73.03 180 bottom
C102  62.87,81.28 180 bottom
C103  62.87,86.36 180 bottom
D1  115.57,88.27 270 top
D2  134.62,42.55 0 top
D3  127,40.64 270 top
D4  134.62,40.01 0 top
D5  135.89,17.78 270 top
HU_CONNECTOR  150.5,15.24 90 top
IC1  59.05,127 0 top
IC2  133.99,117.47 270 top
IC3  112.39,114.94 90 top
IC4  45.09,110.49 180 top
IC5  109.22,103.5 90 top
IC6  141.6,74.3 180 top
IC7  114.94,53.34 90 top
IC8  134.62,29.21 90 top
IC100  MCP2551SO8  [SO08']  135.89,33.02 90 bottom
IC101  74.93,80.64 90 bottom
K1  121.28,17.78 0 top
L1  120.65,75.56 180 top
L2  124.46,63.5 180 top
LM1  143.51,88.27 270 top
MAIN_CONNECTOR  145.41,45.72 270 top
MIC_A  81.28,128.91 0 top
MIC_B  76.2,128.91 0 top
MIC_GND  87.63,128.91 0 top
MONITOR_CON  120.65,29.21 90 top
Q1  66.67,83.82 270 top
Q2  87,68.58 0 top
Q3  118.75,41.27 90 top
Q4  118.75,37.47 90 top
Q5  134.62,34.29 270 top
Q6  135.89,10.16 0 top
Q100  138.43,5.71 270 bottom
Q101  140.34,11.43 90 bottom
Q102  119.38,82.55 90 bottom
R1  75.56,133.35 270 top
R2  75.56,124.46 90 top
R3  120.02,63.5 180 top
R4  104.78,57.15 180 top
R5  123.83,41.27 180 top
R6  123.83,36.83 180 top
R7  127,33.66 0 top
R8  140.34,29.21 270 top
R9  129.54,7.62 0 top
R100  148.59,5.08 0 bottom
R101  144.15,6.35 90 bottom
R102  135.89,8.89 180 bottom
R103  135.89,28.57 180 bottom
R104  127,31.11 0 bottom
R105  127,33.66 180 bottom
R106  108.58,67.31 90 bottom
R107  80.01,76.2 90 bottom
R108  114.3,81.28 180 bottom
R109  80.64,86.36 90 bottom
R110  128.91,88.27 90 bottom
RPI_CONNECTOR  85.09,90.17 270 top
RPI_SPDIFOUT  106.68,12.06 0 top
SV1  99.69,67.31 180 top
USB-BT  38.73,100.33 0 top
USB-GPS  98.42,120.02 270 top

### Tracks (layer width: path | path; a pad name or v marks a point on that pad's centre or on a via)
+3V3  (via drill 0.7 pad 1.42)
  Top 0.61: IC2.19 137.99,121.47 136.53,120.02 130.78,114.28 IC2.6 130.78,105.6 C10.1 | 57.59,113.67 IC1.22 | IC1.21 56.38,113.8 56.52,113.67
  Top 0.813: 123.19,106.05 123.03,106.2
  Top 1.016: C10.1 123.83,105.41 123.19,106.05 | 123.03,106.2 C14.+ 118.36,105.82 IC5.3 112.32,107.39 111.76,107.95 111.12,108.58 77.47,108.58 58.42,108.58 | 56.52,113.67 57.59,113.67 57.59,113.23 57.78,113.03 58.1,112.71 C9.1 58.1,108.9 58.42,108.58 | 58.42,108.58 v58.42,107.31
  Bottom 0.406: 78.11,75.56 77.85,75.82 IC101.20 76.58,77.72 76.2,78.11 76.2,79.38 76.2,80.01 | 79.8,75.56 R107.1
  Bottom 0.61: 76.2,80.01 75.56,80.64 75.56,85.09
  Bottom 1.016: 79.8,75.56 78.11,75.56 77.79,75.25 C101.1 | 75.56,85.09 58.42,102.23 v58.42,107.31
+5V  (via drill 0.7 pad 1.42)
  Top 0.813: v127.64,70.48 125.09,70.48 120.65,74.93 120.65,75.56 | 86.68,102.55 RPI_CONNECTOR.4
  Top 1.016: IC5.1 112.32,99.77 112.32,98.77 C16.1 111.34,93.29 C20.+ 111.76,92.55 111.76,89.53 114.73,86.56 116,86.56 LM1.4 125.04,79.95 120.65,75.56 L1.P$2 112.65,79.75 111.76,80.64 102.87,89.53 102.87,95.89 96.2,102.55 C15.1 86.68,102.55 | RPI_CONNECTOR.4 RPI_CONNECTOR.2
  Bottom 0.5: IC100.3 133.99,33.66 134.94,34.61 C100.1
  Bottom 0.813: C100.1 134.94,45.41 140.97,51.44 140.97,62.87 133.35,70.48 v127.64,70.48
+5V_CONST  (via drill 0.7 pad 1.42)
  Top 0.5: IC7.4 114.53,47.07 C25.1 115.25,46.99 115.57,46.99 116.14,47.55 IC7.6
  Top 0.61: C11.1 138.99,105.91 IC2.11
  Top 0.813: C22.+ 132.56,69.85 130.18,69.85 125.56,65.23 | 125.56,65.23 L2.1 v128.27,63.5 | 125.56,65.23 124.75,66.04 SV1.2 | v117.47,46.99 117.16,46.67 C25.1
  Top 1.016: 136.53,79.09 136.25,79.09 135.89,78.74 135.89,71.12 135.25,70.48 134.78,70.01 C22.+ | 136.53,79.09 IC6.2 | C11.1 139.49,100.11 v139.06,99.69 | v133.99,80.64 135.53,79.09 136.53,79.09
  Bottom 0.813: SV1.2 107.95,66.04 108.37,66.46 R106.1 | v128.27,63.5 129.54,63.5 132.72,60.33 132.72,56.52 123.19,46.99 v117.47,46.99
  Bottom 1.016: v139.06,99.69 132.72,93.34 132.72,81.92 v133.99,80.64
+12V
  Top 0.61: IC8.2 IC8.1 | IC8.2 IC8.3 | R8.2 140.02,28.57 IC8.2
  Top 1.016: C19.1 120.11,91.67 LM1.1 122.41,97.01 123.19,97.79 C17.+ | IC6.1 147.28,79.09 C21.1 150.18,79.06 151.76,77.47 | R8.2 140.34,24.13 137.79,21.59 D5.C
  Top 1.422: C17.+ 128.91,97.63 128.91,95.89 129.54,95.25 148.59,95.25 149.22,94.61 151.76,92.08 151.76,77.47 151.76,59.05 151.76,51.44 151.76,40.64 150.5,39.37 MAIN_CONNECTOR.18
  Bottom 1.016: R110.2 128.91,90.17 127.41,91.67 LM1.1 | K1.1 131.16,23.78 133.7,23.78 D5.C 140.97,21.59 142.24,22.86 142.24,24.77 142.24,26.04 142.88,26.67 147.96,26.67 148.59,27.3 151.76,30.48 151.76,38.1 150.5,39.37 MAIN_CONNECTOR.18
AVCC
  Top 0.5: IC7.18 116.94,59.15 117.47,59.69 C24.2 119.06,61.28 119.38,61.59 120.02,61.59 120.65,61.59 120.86,61.81 R3.1
  Top 0.813: R3.1 L2.2
AVR_INT
  Top 0.5: IC7.25 108.96,56.14 107.95,57.15 R4.1
BT-SPDIFOUT  (via drill 0.7 pad 1.42)
  Top 0.813: IC1.24 59.98,114 60.33,113.67 60.96,113.03 v61.59,113.03
  Top 1.016: v85.09,24.13 v92.71,24.13
  Bottom 0.813: 61.59,111.76 61.59,112.39 | v92.71,24.13 115.44,24.13 K1.NO
  Bottom 1.016: 61.59,112.39 v61.59,113.03 | 61.59,111.76 60.96,111.12 55.88,111.12 55.24,110.49 55.24,53.98 v85.09,24.13
BT_INT  (via drill 0.7 pad 1.42)
  Top 0.813: v72.39,93.34 71.75,93.98 51.44,93.98 43.18,85.72 38.73,85.72 33.66,85.72 27.94,91.44 27.94,111.76 49.53,133.99 49.91,134.37 IC1.3
  Bottom 1.016: RPI_CONNECTOR.13 75.56,90.17 v72.39,93.34
BT_MODE  (via drill 0.7 pad 1.42)
  Top 0.813: v74.93,95.89 50.16,95.89 41.91,87.63 34.29,87.63 29.84,92.08 29.84,101.6 29.84,111.12 43.18,124.46 43.49,124.77 IC1.11
  Bottom 1.016: RPI_CONNECTOR.11 76.2,92.71 74.93,93.98 v74.93,95.89
CAN-H
  Bottom 0.61: IC100.7 141.6,32.38 142.24,31.75 MAIN_CONNECTOR.23
CAN-L
  Bottom 0.61: IC100.6 141.6,33.66 142.24,34.29 MAIN_CONNECTOR.21
CAN_INT
  Bottom 0.406: R109.2 79.38,87.21 78.74,86.58 78.74,82.55 78.46,82.27 IC101.13
  Bottom 1.016: RPI_CONNECTOR.15 83.4,87.21 R109.2
GND  (via drill 0.9 pad 1.42)
  Top 0.406: IC3.18 110.49,117.21 110.49,115.57 | 110.49,113.03 110.49,115.57 | 110.49,113.03 110.49,112.01 IC3.26 | 110.49,113.03 110.49,112.66 IC3.25 105.47,112.66 C8.2 | IC3.21 110.49,115.26 110.49,115.57 | IC3.7 113.99,114.61 113.67,114.94 113.67,120.02 112.39,121.28 109.86,123.83 | 109.22,123.83 USB-GPS.1 | 109.86,123.83 109.22,123.83 | 117.47,123.83 109.86,123.83 | 123.81,130.16 123.19,129.54 | 109.86,123.83 109.22,123.83 | C7.1 96.52,117.47 94.61,119.38 94.61,121.28 93.98,121.92 92.71,121.92 C5.- | C12.1 43.49,104.46 43.18,104.78 42.81,105.14 IC4.18 42.81,108.58 44.45,108.58 | 47.36,108.58 IC4.25 | 47.36,108.58 47.62,108.58 48.01,108.58 | 48.01,108.58 IC4.26 48.01,103.58 C13.2 48.26,103.19 48.26,97.16 45.72,94.61 41.27,90.17 37.47,90.17 36.03,91.6 | IC4.7 45.41,115.88 44.45,116.84 38.73,116.84 34.92,113.03 v34.92,110.49 USB-BT.1 | 47.36,108.58 44.45,108.58 | IC4.21 44.76,108.58 44.45,108.58 | IC1.18 52.28,108.58 48.01,108.58
  Top 0.5: MAIN_CONNECTOR.22 146.05,34.29 145.41,34.92 145.41,41.27 146.05,41.91 MAIN_CONNECTOR.16 | C23.1 113.98,61.27 114.3,60.96 114.53,60.73 IC7.21 114.53,51.2 114.94,50.8 | IC7.5 115.33,50.4 114.94,50.8 | 114.94,50.8 114.3,50.8 113.73,50.23 IC7.3 | C25.2 115.89,43.81 119.38,43.81 119.7,43.5 | 119.7,43.5 119.84,43.35 Q3.E | C24.1 127.8,59.69 C22.- | Q4.E 121.6,38.41 122.56,39.37 128.27,39.37 128.91,40.01 128.91,45.72 128.27,46.35 122.56,46.35 119.7,43.5 | SV1.10 89.53,66.04 88.09,67.48 Q2.E | RPI_CONNECTOR.25 85.09,76.2 85.09,82.55 | 85.09,82.55 85.09,90.17 | 85.09,90.17 85.09,95.25 | 85.09,95.25 RPI_CONNECTOR.9 | 85.09,90.17 RPI_CONNECTOR.14 | 85.09,82.55 RPI_CONNECTOR.20 | RPI_CONNECTOR.6 85.09,99.06 85.09,95.25
  Top 0.61: 142.24,124.46 140.97,124.46 140.19,124.46 IC2.17 140.19,128.4 140.19,133.2 142.24,135.25 | 142.24,124.46 142.38,124.46 IC2.15 142.38,129.03 143.52,130.16 ANT_GPS.5 ANT_GPS.4 | C10.2 131.88,105.82 IC2.7 | C11.2 IC2.13 141.19,111.12 140.34,111.12 | IC2.12 140.09,111.12 140.34,111.12 | 140.34,111.12 141.6,111.12 142.28,111.12 | 142.28,111.12 IC2.14 | 142.28,111.12 142.28,124.46 142.24,124.46 | 87.63,118.75 79.53,118.75 C6.- 78.9,114.46 77.47,113.03 v67.94,113.03 64.77,113.03 | 90.17,118.75 87.63,118.75 | 87.63,118.75 MIC_GND.1 | 64.77,113.03 64.08,113.72 IC1.27 64.08,116.25 62.87,117.47 61.69,118.66 61.69,132.08 | IC1.50 IC1.49 IC1.48 IC1.47 IC1.46 IC1.45 | IC1.45 62.19,136.77 IC1.44 | IC1.50 54.19,136.77 IC1.1 | IC1.50 54.69,126.44 54.69,118.19 54.61,118.11 53.34,116.84 52.28,115.78 IC1.18 | IC1.39 64.89,130.81 62.87,130.81 61.69,131.99 61.69,132.08 | 61.69,132.08 IC1.45 | C9.2 63.5,110.49 64.77,111.76 64.77,113.03 | 146.66,135.25 ANT_GPS.2 | 142.24,135.25 146.66,135.25 | 146.66,135.25 ANT_GPS.2 | ANT_GPS.2 ANT_GPS.3 | 128.91,135.25 123.81,130.16 | 123.81,130.16 117.47,123.83 | 128.91,135.25 142.24,135.25 | 128.91,135.25 123.81,130.16 | Q5.E 134.3,33.34 134.62,33.02 134.62,22.86 132.72,20.95 132.72,19.05 133.35,18.41 137.79,18.41 142.88,23.5 144.85,23.5 HU_CONNECTOR.P2
  Top 0.813: USB-GPS.1 93.82,123.83 C5.- 92.23,122.72 90.17,120.65 90.17,118.75 90.17,114.94 91.75,113.35 C8.2 | IC5.2 116.05,103.5 C14.- | Q6.E 138.6,9.06 139.06,9.53 139.06,14.61 139.7,15.24 HU_CONNECTOR.P6 | C23.1 112.72,63.5 104.14,63.5 102.23,65.41 SV1.4 | RPI_CONNECTOR.6 86.68,100.65 C15.2
  Top 1.016: C14.- 118.75,97.79 119.38,97.16 C19.2 117.79,94.3 117.47,93.98 117.47,88.9 118.11,88.27 LM1.3 | C17.- 132.29,99.64 C10.2 | IC5.2 109.86,103.5 109.22,102.87 109.22,101.6 109.22,98.21 C16.2 107.31,97.79 106.52,97 C20.- | C22.- 141.44,64.61 142.24,65.41 | 142.24,65.41 v142.24,66.67 142.24,71.16 IC6.3 146.01,71.8 146.05,71.75 147.32,73.03 C21.2 | MAIN_CONNECTOR.16 148.59,41.91 149.22,42.55 149.22,61.59 145.41,65.41 142.24,65.41 | HU_CONNECTOR.P1 150.5,33.02 149.22,34.29 MAIN_CONNECTOR.22 | USB-BT.1 34.92,95.72 C18.- 36.03,91.6
  Bottom 0.406: C103.1 61.91,87.95 62.23,88.27 68.58,88.27 72.01,84.83 IC101.10 73.91,83.57 74.3,83.19 74.3,79.38 75.56,78.11 75.56,71.75 76.83,70.48 79.38,70.48 79.69,70.8
  Bottom 0.5: C100.2 136.84,32.91 135.04,31.11
  Bottom 0.61: Q102.E 116.53,83.5 D1.A | R104.1 129.54,31.11 130.81,32.38 IC100.2 134.62,32.38 135.04,31.96 135.04,31.11 R103.1 135.25,28.36 135.25,26.67 135.89,26.04 139.7,26.04 142.24,28.57 147.32,28.57 150.5,31.75 150.5,33.02 149.22,34.29 MAIN_CONNECTOR.22
  Bottom 0.813: Q101.E 139.24,14.78 139.7,15.24 HU_CONNECTOR.P6 HU_CONNECTOR.P5 | HU_CONNECTOR.P5 HU_CONNECTOR.P3 | R100.1 150.5,5.08 153.03,7.62 153.03,12.7 HU_CONNECTOR.P5 | MONITOR_CON.2 121.28,30.48 122.56,29.21 126.36,29.21 127.64,29.21 127.85,29.43 R104.1 | SV1.4 SV1.6 SV1.8 SV1.10
  Bottom 1.016: LM1.3 117.47,88.27 116.2,87 115.57,86.36 D1.A | HU_CONNECTOR.P2 HU_CONNECTOR.P1 HU_CONNECTOR.P3 | C102.1 C103.1 | RPI_CONNECTOR.25 81.92,73.03 C101.2 79.69,70.8
  other vias: 44.45,134.62 44.45,121.28 98.42,128.91 112.39,128.91 147.32,106.05 147.32,98.42 147.32,91.44 45.09,74.93 66.04,74.3 44.45,60.33 66.04,60.33 44.45,48.26 66.04,47.62 66.04,5.71 97.16,18.41 104.14,18.41 85.09,40.01 92.71,40.01 147.32,66.67 147.32,72.39 147.32,82.55 98.42,80.64 98.42,88.9 107.31,80.64 52.7,110.49
  pour Bottom (isolate 0.61): 0.64,137.79 154.31,137.79 154.31,0 0.64,0
  pour Top (isolate 0.61): 0.64,137.79 154.31,137.79 154.31,0 0.64,0
I2C_SCL
  Top 0.5: IC7.28 88.5,53.74 88.27,53.98 80.01,62.23 80.01,99.69 80.01,102.87 81.28,104.14 84.45,104.14 85.09,103.5 85.09,101.6 RPI_CONNECTOR.5
I2C_SDA
  Top 0.5: RPI_CONNECTOR.3 81.92,102.87 81.28,102.23 81.28,62.87 83.19,60.96 89.61,54.54 IC7.27
INGITION_ON
  Bottom 0.5: MAIN_CONNECTOR.10 145.41,48.26 144.15,48.26 142.88,48.26 141.6,46.99 141.6,41.91 139.7,40.01 D4.A
INPUT_SELECT  (via drill 0.7 pad 1.42)
  Top 1.016: R9.1 102.87,7.62 100.97,9.53 100.97,38.73 85.09,54.61 78.11,61.59 v78.11,95.89
  Bottom 1.016: v78.11,95.89 80.01,97.79 RPI_CONNECTOR.7
MIC_A
  Top 0.61: 75.25,132.08 R1.2 | C1.2 75.25,132.08 | 75.25,132.08 R1.2 | MIC_A.1 81.28,130.81 79.69,132.4 R1.2
MIC_B
  Top 0.61: R2.2 75.56,128.27 MIC_B.1 74.3,128.91 73.66,129.54 C2.2
MONITOR_ON
  Top 0.5: 108.58,40.64 108.58,50.8 109.12,51.34 IC7.31
  Top 0.61: R7.1 115.57,33.66 108.58,40.64
N$1
  Bottom 0.61: R103.2 138.43,28.57 138.96,29.11 IC100.8
N$2  (via drill 0.7 pad 1.42)
  Top 1.016: v85.09,30.48 v92.71,30.48
  Bottom 0.406: IC101.1 72.78,77.72 73.03,77.47
  Bottom 0.61: 73.03,77.47 73.03,42.55 v85.09,30.48 | v92.71,30.48 113.67,30.48 118.75,25.4 126.36,25.4 127.64,26.67 130.81,29.84 132.08,31.11 IC100.1
N$3
  Bottom 0.61: IC100.4 130.18,34.92 128.91,33.66 R105.2
N$4
  Bottom 0.406: IC101.9 69.99,82.92 Q1.1
  Bottom 1.016: C103.2 66.55,86.36 Q1.1
N$5
  Bottom 0.406: IC101.19 79.75,78.37 80.01,78.11 R107.2
N$6  (via drill 0.7 pad 1.42)
  Top 1.016: v85.09,34.29 v92.71,34.29
  Bottom 0.406: 74.03,78.37 IC101.2
  Bottom 0.61: R105.1 R104.2 | 74.03,78.37 74.3,78.11 74.3,45.09 v85.09,34.29
  Bottom 1.016: v92.71,34.29 93.34,33.66 R105.1
N$7
  Bottom 0.406: IC101.8 67.54,82.27 Q1.2
  Bottom 1.016: C102.2 66.55,81.28 Q1.2
N$8
  Top 0.61: IC1.38 64.97,129.54 66.04,129.54 66.67,129.54 68.58,131.44 69.22,132.08 C1.1
N$9  (via drill 0.7 pad 1.42)
  Top 0.5: v127.64,58.42 122.56,58.42 121.77,57.63 IC7.17
  Bottom 0.813: SV1.7 97.16,70.48 98.42,71.75 99.69,73.03 113.03,73.03 v127.64,58.42
N$10
  Top 0.5: IC7.20 115.33,60.73 115.57,60.96 115.89,61.27 C23.2
N$11
  Top 0.5: IC7.29 112,52.94 112.39,53.34 112.39,55.88 111.12,57.15 108.58,59.69 105.41,59.69 100.97,64.14 100.97,67.31 SV1.5
  Bottom 0.5: SV1.5 99.69,67.94 100.33,67.31 104.14,67.31 106.05,67.31 106.89,68.16 R106.2
N$12  (via drill 0.7 pad 1.42)
  Top 0.5: IC7.16 122.18,56.14 123.19,57.15 128.91,57.15 129.54,57.15 v130.81,58.42
  Bottom 0.813: v130.81,58.42 114.3,74.93 109.22,74.93 99.06,74.93 94.61,70.48 SV1.9
N$13  (via drill 0.7 pad 1.42)
  Top 0.5: IC7.15 123.92,55.34 v124.46,55.88
  Bottom 0.813: v124.46,55.88 124.46,59.69 112.39,71.12 106.05,71.12 104.78,69.85 SV1.1
N$14
  Bottom 1.016: RPI_CONNECTOR.17 83.4,85.51 R109.1
N$15
  Top 0.406: C13.1 46.04,104.45 45.72,104.78 45.09,105.41 44.45,105.41 44.11,105.75 IC4.20
  Top 0.813: C18.+ 42.55,95.72 USB-BT.4
  Top 1.016: USB-BT.4 45.09,100.33 45.72,100.97 46.04,101.28 C13.1
N$16
  Top 0.406: IC1.16 51.41,118.75 48.26,118.75 46.71,117.19 IC4.5
N$17
  Top 0.406: IC4.16 41.51,105.64 41.27,105.41 40.64,105.41 40.01,104.78 USB-BT.3
N$18
  Top 0.406: IC4.15 38.92,106.86 37.47,105.41 USB-BT.2
N$19
  Top 0.406: IC1.17 51.34,117.47 50.16,117.47 49.31,116.62 IC4.1
N$20
  Top 0.406: IC3.4 114.03,112.66 112.39,114.3 112.39,116.84 111.38,117.86 IC3.17 105.47,117.86 C7.2
N$21
  Top 0.813: MONITOR_CON.1 121.28,27.3 IC8.8 IC8.7 IC8.6 IC8.5
N$22
  Top 0.406: C12.2 41.59,104.46 41.91,104.78 42.16,105.03 IC4.17 42.16,109.47 42.55,109.86 43.18,110.49 46.35,110.49 47.36,111.5 IC4.4
N$23
  Bottom 0.813: Q101.B 139.06,10.31 139.06,9.53 138.43,8.89 R102.2
N$24
  Bottom 0.61: R108.2 115.57,81.6
  Bottom 1.016: 115.57,81.6 Q102.B
N$25
  Bottom 1.016: R110.1 128.91,85.72 128.04,84.86 LM1.5 122.41,83.04 121.92,82.55 Q102.C
N$26
  Top 0.61: Q3.C 113.67,41.27 112.14,42.8 IC7.1
N$27
  Top 0.813: Q4.B 122.56,36.52 R6.2
N$28
  Top 0.61: Q4.C 114.3,37.47 110.64,41.12 IC7.32
N$29
  Top 0.61: Q3.B 121.92,40.33 R5.2
N$30  (2 unrouted)
  Bottom 1.016: 127,37.47 128.27,38.73 129.54,40.01 D4.C
N$31  (2 unrouted)
  Top 0.61: R5.1 126.36,41.27 127,41.91
  Bottom 1.016: D2.C 128.91,44.45
N$32
  Bottom 1.016: R101.2 148.91,7.3 150.5,8.89 HU_CONNECTOR.P7
N$33
  Bottom 0.813: 144.47,5.08 144.78,5.08 144.47,5.39 142.56,5.39 142.24,5.71 141.29,6.67 Q100.B
  Bottom 1.016: 144.78,5.08 R100.2 | 144.47,5.08 R101.1
N$34
  Bottom 1.016: Q101.C 144.6,11.43 HU_CONNECTOR.P8
N$35
  Top 0.5: RPI_CONNECTOR.22 87,80.01 89.53,77.47 89.53,71.12 88.09,69.68 Q2.C
N$36
  Top 0.5: R4.2 95.25,57.15 86.36,66.04 86.05,66.36 Q2.B
N$37
  Top 0.813: D5.A Q6.C
  Bottom 1.016: K1.2 133.7,11.78 D5.A
N$38
  Top 0.61: IC1.43 71.44,135.57 AUX_L.1
N$39
  Top 0.61: IC1.42 67.56,134.37 AUX_R.1
N$40
  Top 0.813: R9.2 131.44,7.62 132.72,8.89 132.88,9.06 Q6.B
N$41
  Top 1.016: L1.P$1 128.27,75.94 128.27,87.63 125.94,89.97 LM1.2
  Bottom 1.016: LM1.2 117.68,89.97 D1.C
N$43
  Top 0.61: IC1.37 67.41,128.37 67.94,128.91 68.58,129.54 C2.1
N$45
  Bottom 1.016: K1.NC 115.5,12.06 RPI_SPDIFOUT.1
N$48
  Top 0.61: IC1.35 67.07,125.97 67.94,125.09 68.58,124.46 C4.1
N$49
  Top 0.61: IC1.34 66.36,124.77 67.31,123.83 68.58,122.56 | 68.58,122.56 71.12,122.56 72.07,123.5 C4.2 | C4.2 C3.2 | C4.2 73.66,124.46 74.61,123.51 R2.1 83.5,123.51 83.82,123.83 84.45,124.46 84.45,132.08 82.23,134.3 R1.1 | C6.+ 70.48,118.11 68.58,120.02 68.58,122.56
N$50
  Top 0.61: IC1.36 70,127.17 C3.1
N$53
  Top 0.61: Q5.B 130.49,35.24 130.18,34.92 128.91,33.66 R7.2
N$56
  Top 0.61: ANT_GPS.1 142.24,132.72 141.28,131.76 IC2.16
N$62
  Top 0.406: IC3.5 125.3,113.31 127.48,111.12
  Top 0.61: IC2.4 128.59,111.12 127.64,111.12 127.48,111.12 IC2.3
N$67
  Top 0.61: R8.1 140.34,30.48 | IC8.4 137.16,31.19 137.16,34.29
  Top 0.813: Q5.C 137.16,34.29 137.79,34.29 138.43,34.29 140.34,32.38 R8.1
N$68
  Top 0.406: IC3.20 105.44,115.91 C8.1
  Top 0.813: C8.1 99.38,115.25 USB-GPS.4 93.82,116.2 C5.+
N$70
  Top 0.406: IC3.16 106.92,118.51 106.05,119.38 99.06,119.38 USB-GPS.3
N$71
  Top 0.406: IC3.15 107.53,119.16 107.31,119.38 105.41,121.28 USB-GPS.2
PILOT_1
  Top 0.5: IC7.14 133.91,54.54 138.43,59.05 139.06,59.69 MAIN_CONNECTOR.1
PILOT_2
  Top 0.5: IC7.13 135.02,53.74 138.43,57.15 MAIN_CONNECTOR.3
PILOT_3
  Top 0.5: IC7.12 136.12,52.94 137.16,53.98 137.79,54.61 MAIN_CONNECTOR.5
PILOT_4
  Top 0.5: IC7.11 144.07,52.14 MAIN_CONNECTOR.7
PILOT_5
  Top 0.5: MAIN_CONNECTOR.9 137.79,49.53 135.99,51.34 IC7.10
PILOT_6
  Top 0.5: IC7.9 134.88,50.54 137.79,47.62 138.43,46.99 MAIN_CONNECTOR.11
POWER_ON  (via drill 0.7 pad 1.42)
  Top 0.5: v109.22,61.59 111.12,61.59 112.94,59.78 IC7.23
  Bottom 1.016: R108.1 108.91,76.83 105.41,76.83 97.16,76.83 92.08,71.75 92.08,66.67 92.08,65.41 95.89,61.59 v109.22,61.59
RADIO_ON
  Bottom 0.5: MAIN_CONNECTOR.8 145.41,50.8 142.88,50.8 140.34,48.26 140.34,43.81 139.06,42.55 D2.A
SPDIF_IN
  Bottom 1.016: K1.C 137.16,17.78 138.82,19.44 HU_CONNECTOR.P4
SPI_CS
  Bottom 0.406: IC101.18 81.64,79.02 81.92,78.74 81.92,77.47 83.19,76.2 85.09,76.2 RPI_CONNECTOR.26
SPI_MISO
  Bottom 0.406: RPI_CONNECTOR.21 83.48,79.67 IC101.17
SPI_MOSI
  Bottom 0.406: IC101.16 81.59,80.32 81.92,80.64 RPI_CONNECTOR.19
SPI_SCK
  Bottom 0.406: IC101.14 80.35,81.62 82.55,83.82
  Bottom 0.5: 82.55,83.82 84.45,83.82 85.09,83.19 85.09,78.74 RPI_CONNECTOR.23
TEMP_OUT  (via drill 0.7 pad 1.42)
  Top 0.5: R3.2 118.11,63.5 117.47,62.87 117.47,62.23 117.47,60.96 116.14,59.62 IC7.19 116.14,52.14 118.75,49.53 133.35,49.53
  Top 0.61: v141.6,38.1 141.6,42.55 141.6,43.18 139.06,45.72 137.16,45.72 133.35,49.53
  Bottom 0.5: MAIN_CONNECTOR.20 145.41,38.1 142.88,38.1 v141.6,38.1
UART_RX
  Bottom 1.016: RPI_CONNECTOR.10 89.53,95.25 91.44,93.34 91.44,76.83 87.63,73.03 87.63,10.79 92.71,5.71 Q100.C
UART_TX
  Bottom 1.016: R102.1 92.71,8.89 89.53,12.06 89.53,72.39 94.61,77.47 94.61,95.25 92.08,97.79 RPI_CONNECTOR.8

### Text on the board
Top: GG 2014 | CarPI v3